# Altium schematic sheet Battery Charger.SchDoc
size A
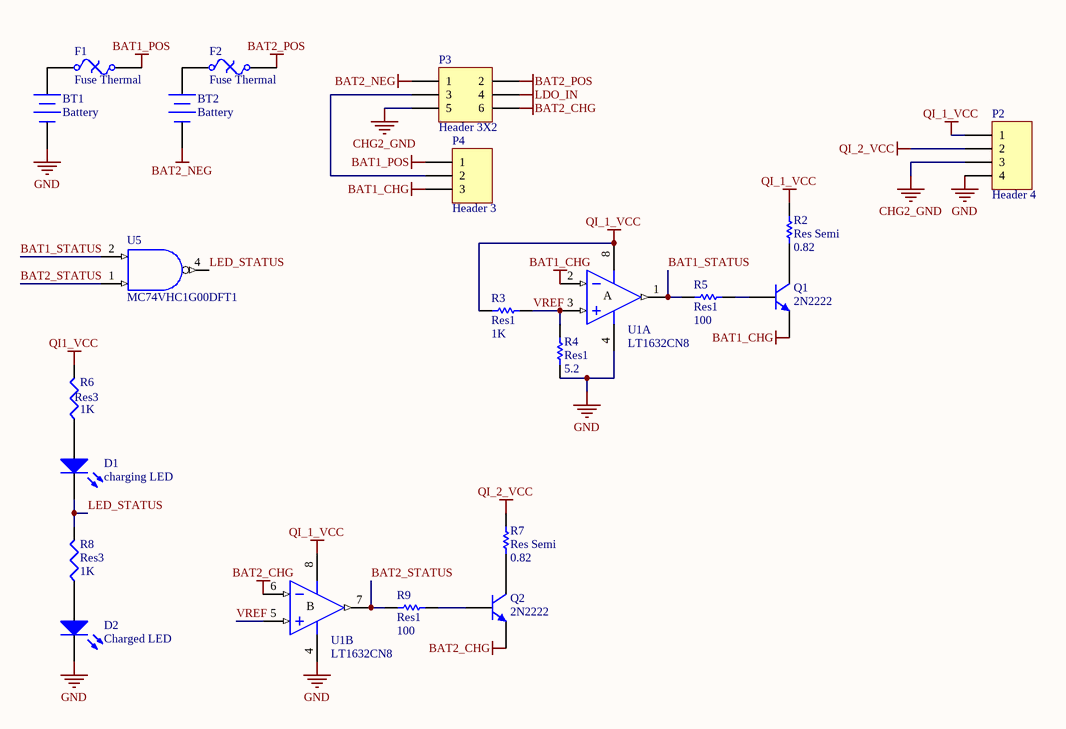
[diagram p0: Battery Charger.SchDoc]

## Parts
BT1  Battery  [BAT-2]
BT2  Battery  [BAT-2]
D1  charging LED  [LED-0]
D2  Charged LED  [LED-0]
F1  Fuse Thermal  [PIN-W2/E2.8]
F2  Fuse Thermal  [PIN-W2/E2.8]
P2  Header 4  [HDR1X4]
P3  Header 3X2  [HDR2X3]
P4  Header 3  [HDR1X3]
Q1  2N2222  [TO-92A]
Q2  2N2222  [TO-92A]
R2  Res Semi  value 0.82  [AXIAL-0.5]
R3  Res1  value 1K  [AXIAL-0.3]
R4  Res1  value 5.2  [AXIAL-0.3]
R5  Res1  value 100  [AXIAL-0.3]
R6  Res3  value 1K  [14-1210]
R7  Res Semi  value 0.82  [AXIAL-0.5]
R8  Res3  value 1K  [14-1210]
R9  Res1  value 100  [AXIAL-0.3]
U1  LT1632CN8  [DIP-8]  (parts A,B of 2)
U5  MC74VHC1G00DFT1  [419A-01_N]

## Nets
BAT1_CHG: P4.3 Q1.1(E) U1.2(IN-)
BAT1_POS: F1.1 P4.1
BAT2_CHG: P3.6 Q2.1(E) U1.6(IN-)
BAT2_NEG: BT2.2(-) P3.1
BAT2_POS: F2.1 P3.2
CHG2_GND: P2.3 P3.5
GND: BT1.2(-) D2.2(K) P2.4 R4.1 U1.4(V-) U5.3(GND)
LDO_IN: P3.4
QI1_VCC: R6.2
QI_1_VCC: P2.1 R2.2 R3.1 U1.8(V+)
QI_2_VCC: P2.2 R7.2
VDD: U5.5(VDD)
BAT1_STATUS: R5.1 U1.1(OUT) U5.2(A)
BAT2_STATUS: R9.1 U1.7(OUT) U5.1(B)
LED_STATUS: D1.2(K) R8.2 U5.4(~{Y})
VREF: R3.2 R4.2 U1.3(IN+) U1.5(IN+)
NetBT1_1: BT1.1(+) F1.2
NetBT2_1: BT2.1(+) F2.2
NetD1_1: D1.1(A) R6.1
NetD2_1: D2.1(A) R8.1
NetP3_3: P3.3 P4.2
NetQ1_2: Q1.2(B) R5.2
NetQ1_3: Q1.3(C) R2.1
NetQ2_2: Q2.2(B) R9.2
NetQ2_3: Q2.3(C) R7.1

## Notes on the sheet
- (in symbol LT1632CN8, part A) A
- (in symbol LT1632CN8, part B) B

## Library data of the parts
BT1 BT2 = Battery: Multicell Battery; Published: 24-Mar-1999; LatestRevisionDate: 17-Jul-2002; LatestRevisionNote: Re-released for DXP Platform.; PackageReference: BAT-2; Publisher: Altium Limited; PackageDescription: Battery; 2 Leads
D1 D2 = LED0: Typical INFRARED GaAs LED; Published: 8-Jun-2000; LatestRevisionDate: 08-Jul-2005; LatestRevisionNote: Mech Layer 1 removed.; PackageReference: LED-0; Publisher: Altium Limited; PackageDescription: LED; 2 Leads
F1 F2 = Fuse Thermal: Thermal Fuse; Published: 24-Mar-1999; LatestRevisionDate: 17-Jul-2002; LatestRevisionNote: Re-released for DXP Platform.; PackageReference: PIN-W2/E2.8; Publisher: Altium Limited; PackageDescription: Thru-Hole; 2 Leads
P2 = Header 4: Header, 4-Pin; LatestRevisionDate: 17-Jul-2002; LatestRevisionNote: Re-released for DXP Platform.; Publisher: Altium Limited
P3 = Header 3X2: Header, 3-Pin, Dual row; LatestRevisionDate: 17-Jul-2002; LatestRevisionNote: Re-released for DXP Platform.; Publisher: Altium Limited
P4 = Header 3: Header, 3-Pin; LatestRevisionDate: 17-Jul-2002; LatestRevisionNote: Re-released for DXP Platform.; Publisher: Altium Limited
Q1 Q2 = 2N3904: NPN General Purpose Amplifier; Published: 8-Jun-2000; LatestRevisionDate: 15-Jan-2003; LatestRevisionNote: PCB Footprint 'BCY-W3/D4.7' replaced; DatasheetVersion: 1997; PackageVersion: Sep-1998; PackageReference: TO-92A; Publisher: Altium Limited; PackageDescription: TO, Flat Index; 3 In-Line, Axial Leads; Body Dia. 4.5mm; Leads 0.51 x 0.48 mm (max); ComponentLink1Description: Manufacturer Link; ComponentLink1URL: http://www.fairchildsemi.com/; ComponentLink2Description: Datasheet; ComponentLink2URL: http://www.fairchildsemi.com/ds/2N%2F2N3904.pdf
R2 R7 = Res Semi: Semiconductor Resistor; Published: 8-Jun-2000; LatestRevisionDate: 17-Jul-2002; LatestRevisionNote: Re-released for DXP Platform.; PackageReference: AXIAL-0.5; Publisher: Altium Limited; PackageDescription: Axial Device, Thru-Hole; 2 Leads; 0.5 in Pin Spacing
R3-R5 R9 = Res1: Resistor; Published: 8-Jun-2000; LatestRevisionDate: 17-Jul-2002; LatestRevisionNote: Re-released for DXP Platform.; PackageReference: AXIAL-0.3; Publisher: Altium Limited; PackageDescription: Axial Device, Thru-Hole; 2 Leads; 0.3 in Pin Spacing
R6 R8 = Res3: Resistor; Published: 8-Jun-2000; LatestRevisionDate: 29-May-2009; LatestRevisionNote: IPC-7351 Footprint Added.; PackageReference: J1-0603; Publisher: Altium Limited; PackageDescription: Chip Resistor
U1 = LT1632CN8: 45MHz, 45V/µs, Dual Rail-to-Rail Input and Output Precision Operational Amplifier; Note: 1455; Published: 8-Jun-2000; LatestRevisionDate: 29-May-2009; LatestRevisionNote: Component Body Added.; DatasheetVersion: 1996; PackageVersion: N8 1002; PackageReference: N8; Publisher: Altium Limited; PackageDescription: DIP, Plastic, 8-Pin, Row Spacing 7.62 mm, Pitch 2.54 mm; ComponentLink1Description: Manufacturer Link; ComponentLink1URL: http://www.linear.com/; ComponentLink2Description: Datasheet; ComponentLink2URL: http://www.linear.com/pc/downloadDocument.do?navId=H0,C1,C1154,C1009,C1022,P1642,D3055
U5 = MC74VHC1G00DFT1: 2-Input NAND Gate; Published: 15-Apr-2002; LatestRevisionDate: 12-Dec-2006; LatestRevisionNote: IPC-7351 Footprint Added.; DatasheetVersion: Dec-1999; PackageVersion: Oct-1999; PackageReference: 419A-01; Publisher: Altium Limited; PackageDescription: 5-Pin SOT-353 Package 0.65 mm Pitch, 2.1 mm Lead Span; ComponentLink1Description: Manufacturer Link; ComponentLink1URL: http://www.onsemi.com/; ComponentLink2Description: Datasheet; ComponentLink2URL: http://www.onsemi.com/pub/Collateral/MC74VHC1G00-D.PDF